# EasyEDA schematic PCB_SCHEMATIC.json
TITLE: Sheet_1; REV: 1.0; Date: 2021-10-17; Sheet: 1/1; Company: Your Company
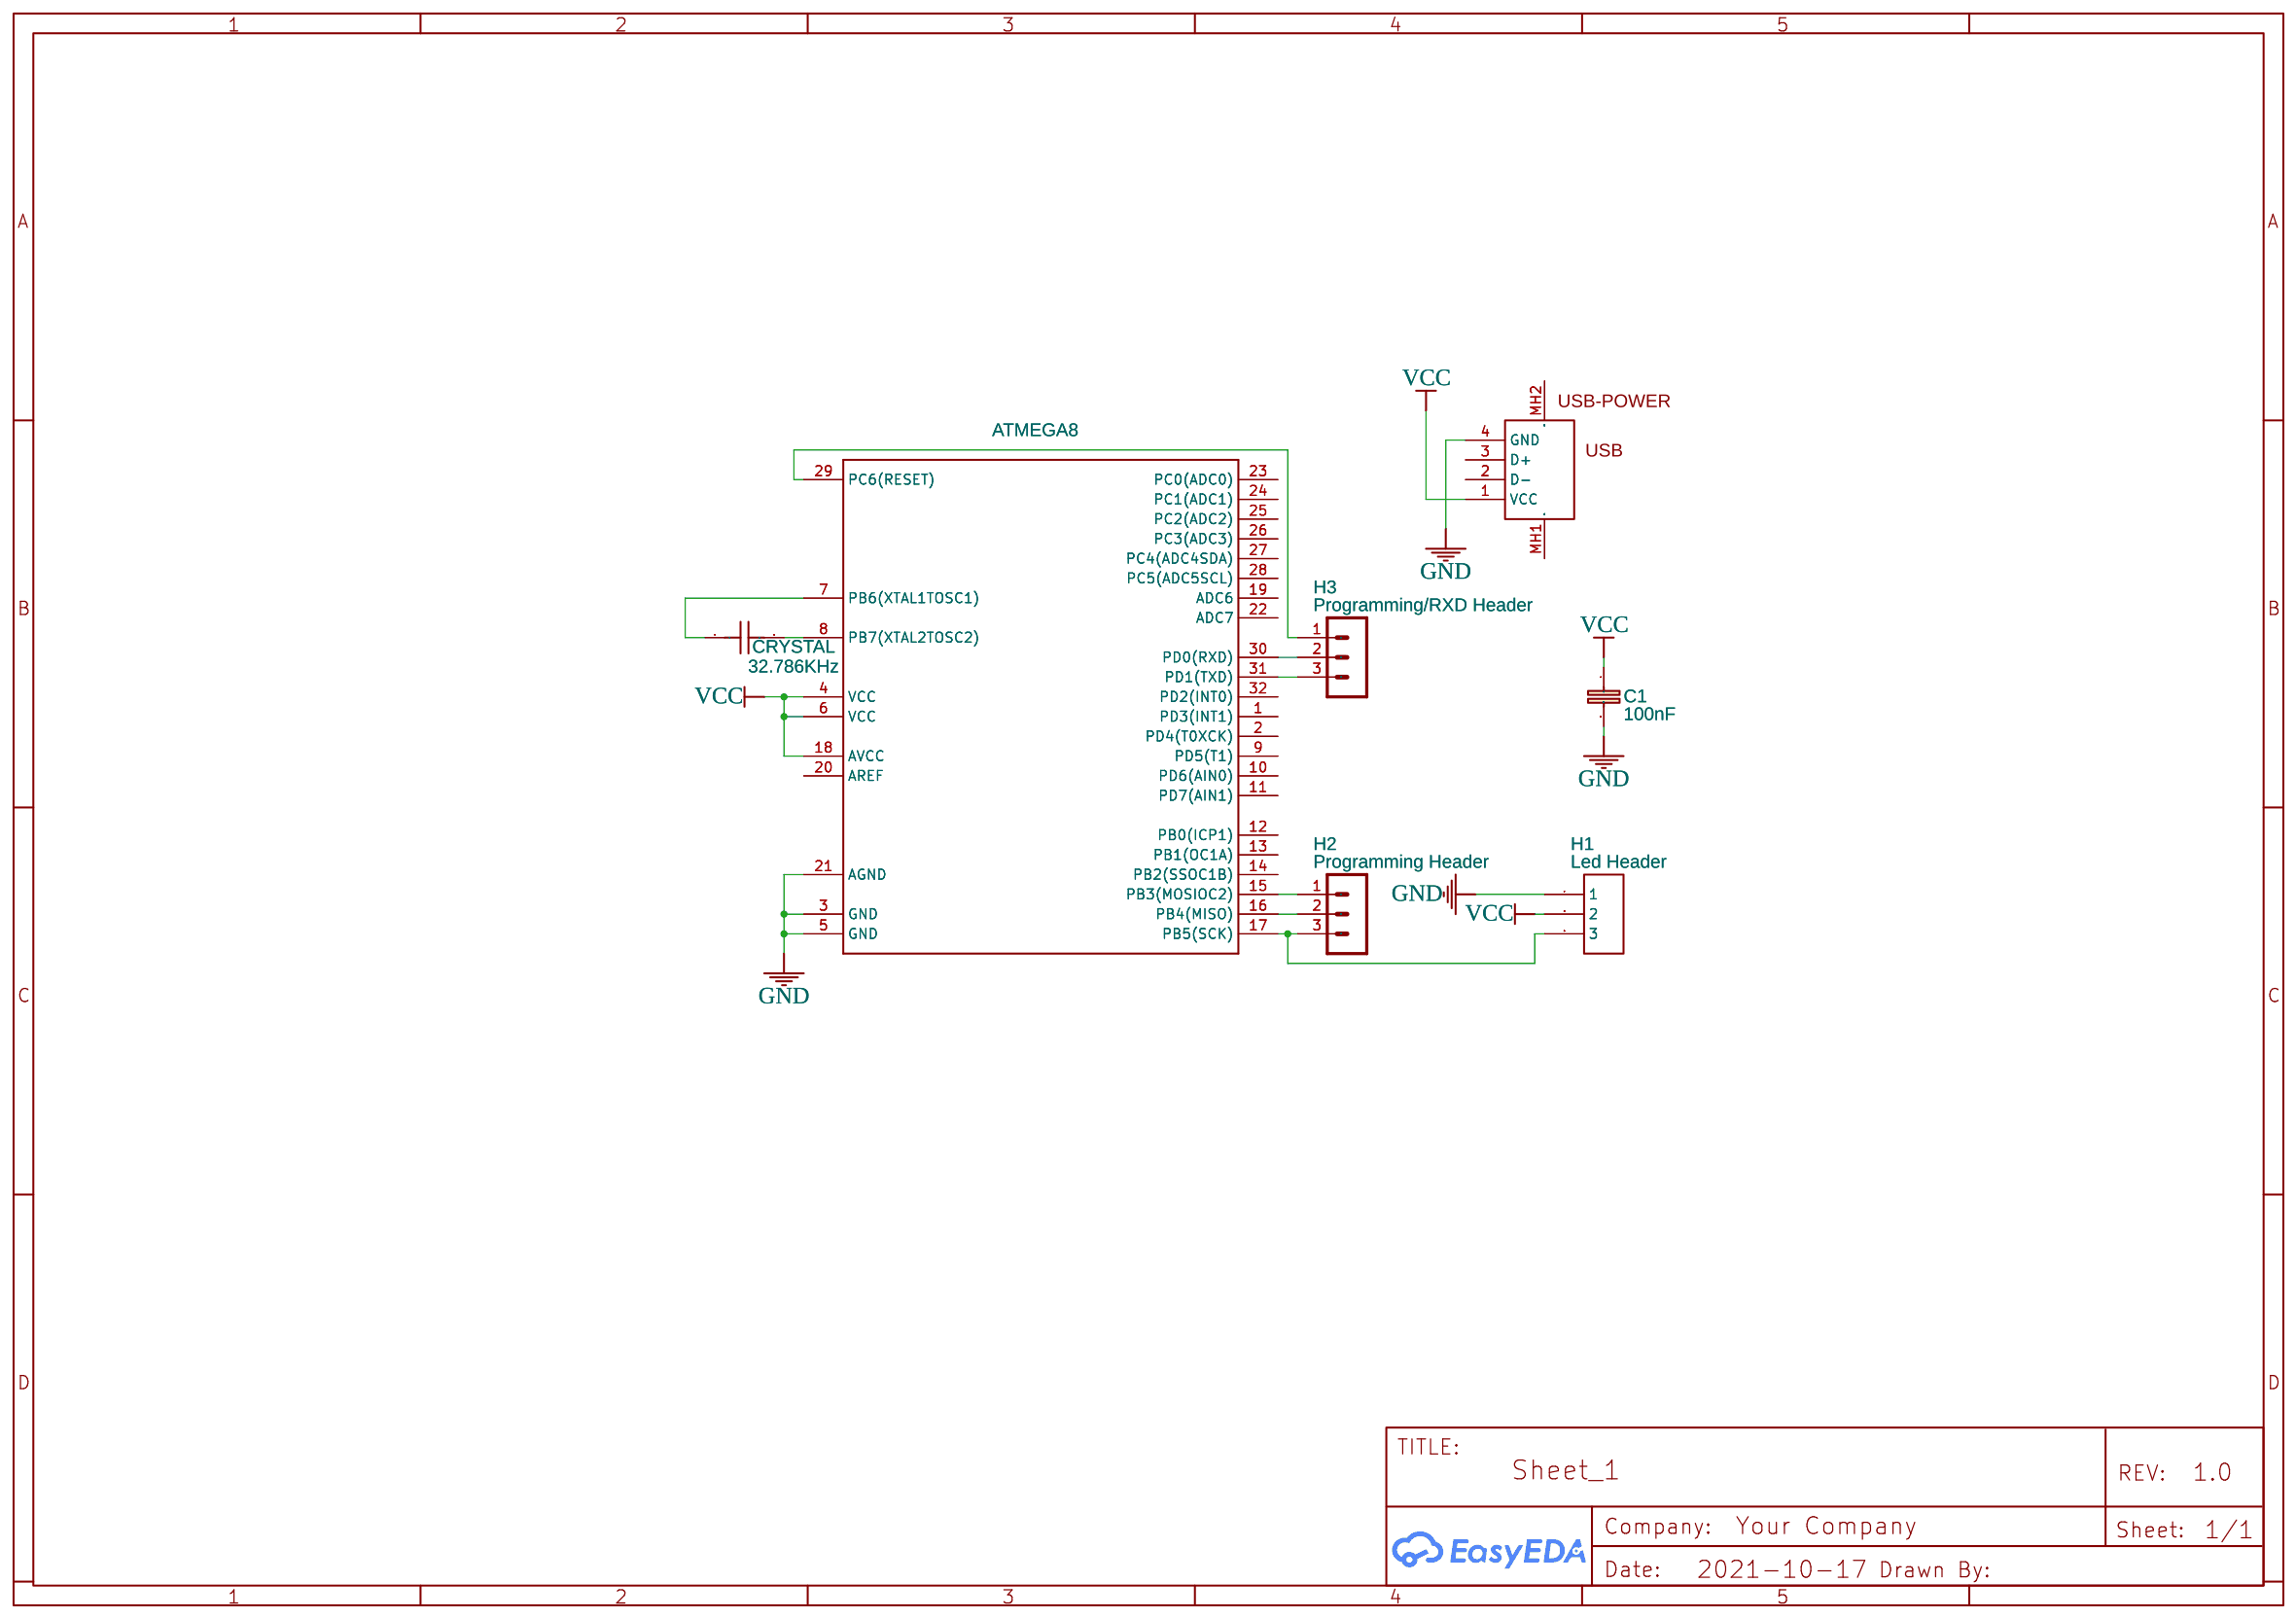
[diagram p0: schematic sheet]

## Parts
C1  100nF  [C1206]
CRYSTAL  32.786KHz  [C0805]
H1  Led Header  [HEADER_1X3_SMD]
H2  Programming Header  [3PIN-HEADER]
H3  Programming/RXD Header  [3PIN-HEADER]
U1  ATMEGA8  [TQFP32-08]
U4  USB  [USB_MALE_USBKEY]

## Library data of the parts
C1 = CAPACITOR_NPOL-1206: Non-Polarized capacitor in various packages; Contributor: DangerousPrototype
CRYSTAL = C_0805_US: Contributor: LCEDA_Lib
H1 = Header_Female_2.54mm_1x3_SMD: Supplier: Digi-Key; Manufacturer: ReliaPro; Manufacturer Part: Female header pitch2.54mm; Supplier Part: SSM-104-T-SV-BE-ND; Contributor: rajunamburi
H2 H3 = 3PIN-HEADER: Contributor: pizza21000
U1 = ATMEGA8-AU
U4 = USB_MALE_USBKey: Contributor: mrilic66

## Nets
GND: C1.2 H1.1 U1.3(GND) U1.5(GND) U1.21(AGND) U4.4(GND)
VCC: C1.1 H1.2 U1.4(VCC) U1.6(VCC) U1.18(AVCC) U4.1(VCC)
Net-(CRYSTAL-1): CRYSTAL.1 U1.7(PB6(XTAL1TOSC1))
Net-(CRYSTAL-2): CRYSTAL.2 U1.8(PB7(XTAL2TOSC2))
Net-(H1-3): H1.3 H2.3 U1.17(PB5(SCK))
Net-(H2-1): H2.1 U1.15(PB3(MOSIOC2))
Net-(H2-2): H2.2 U1.16(PB4(MISO))
Net-(H3-1): H3.1 U1.29(PC6(RESET))
Net-(H3-2): H3.2 U1.30(PD0(RXD))
Net-(H3-3): H3.3 U1.31(PD1(TXD))

Not connected (* = marked no-connect by the designer): U1 1(PD3(INT1)) 2(PD4(T0XCK)) 9(PD5(T1)) 10(PD6(AIN0)) 11(PD7(AIN1)) 12(PB0(ICP1)) 13(PB1(OC1A)) 14(PB2(SSOC1B)) 19(ADC6) 20(AREF) 22(ADC7) 23(PC0(ADC0)) 24(PC1(ADC1)) 25(PC2(ADC2)) 26(PC3(ADC3)) 27(PC4(ADC4SDA)) 28(PC5(ADC5SCL)) 32(PD2(INT0)); U4 2(D-) 3(D+) MH1 MH2
